# EasyEDA Pro project 2025智能物流搬运_PCB_XAUT_20250927.eprj, schematic Schematic1
Board Name: Board1; Create Date: 2025-06-13; Page Name: P1; Project Name: 8mm金属按钮转接板; Schematic Name: Schematic1; Update Date: 2025-06-13; Company: 嘉立创EDA; Page Size: A4; Version: V1.0
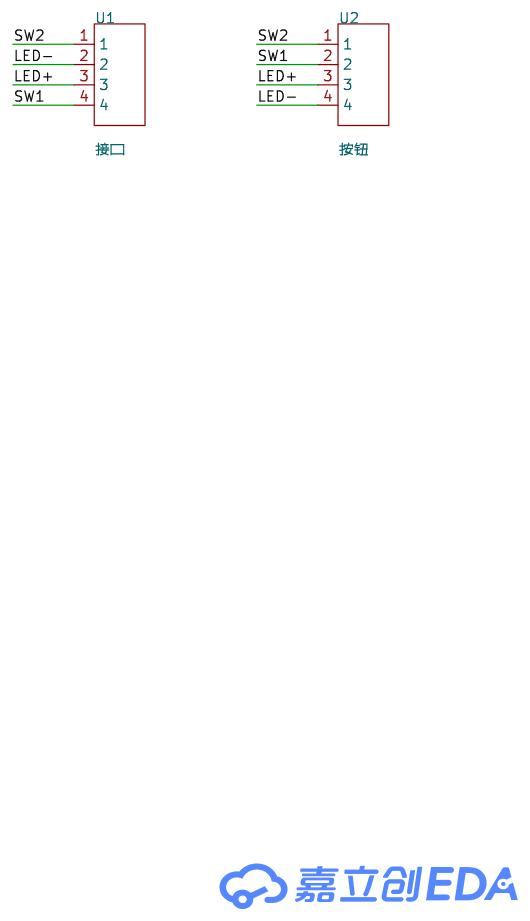
[diagram p6: schematic sheet]

## Parts
U1  接口  [CONN-SMD_4P-P1.25_GH1.25-4P]
U2  按钮  [SW-TH_3P-L12.8-W6.0-P5.08]

## Library data of the parts
U1 = GH1.25-4P卧贴: Supplier Part: C9900014670; JLCPCB Part Class: 扩展库; Supplier: LCSC
U2 = D2FD-01L30-1H: LCSC Part Name: 开关; Supplier Part: C2734434; Manufacturer: OMRON(欧姆龙); JLCPCB Part Class: 扩展库; Datasheet: https://atta.szlcsc.com/upload/public/pdf/source/20221128/B5654D96754B90FF70874F1211AC0572.pdf; Supplier: LCSC

## Nets
LED+: U1.3 U2.3
LED-: U1.2 U2.4
SW1: U1.4 U2.2
SW2: U1.1 U2.1
